# EAGLE schematic RPU_BUS (EAGLE 7.6.0)
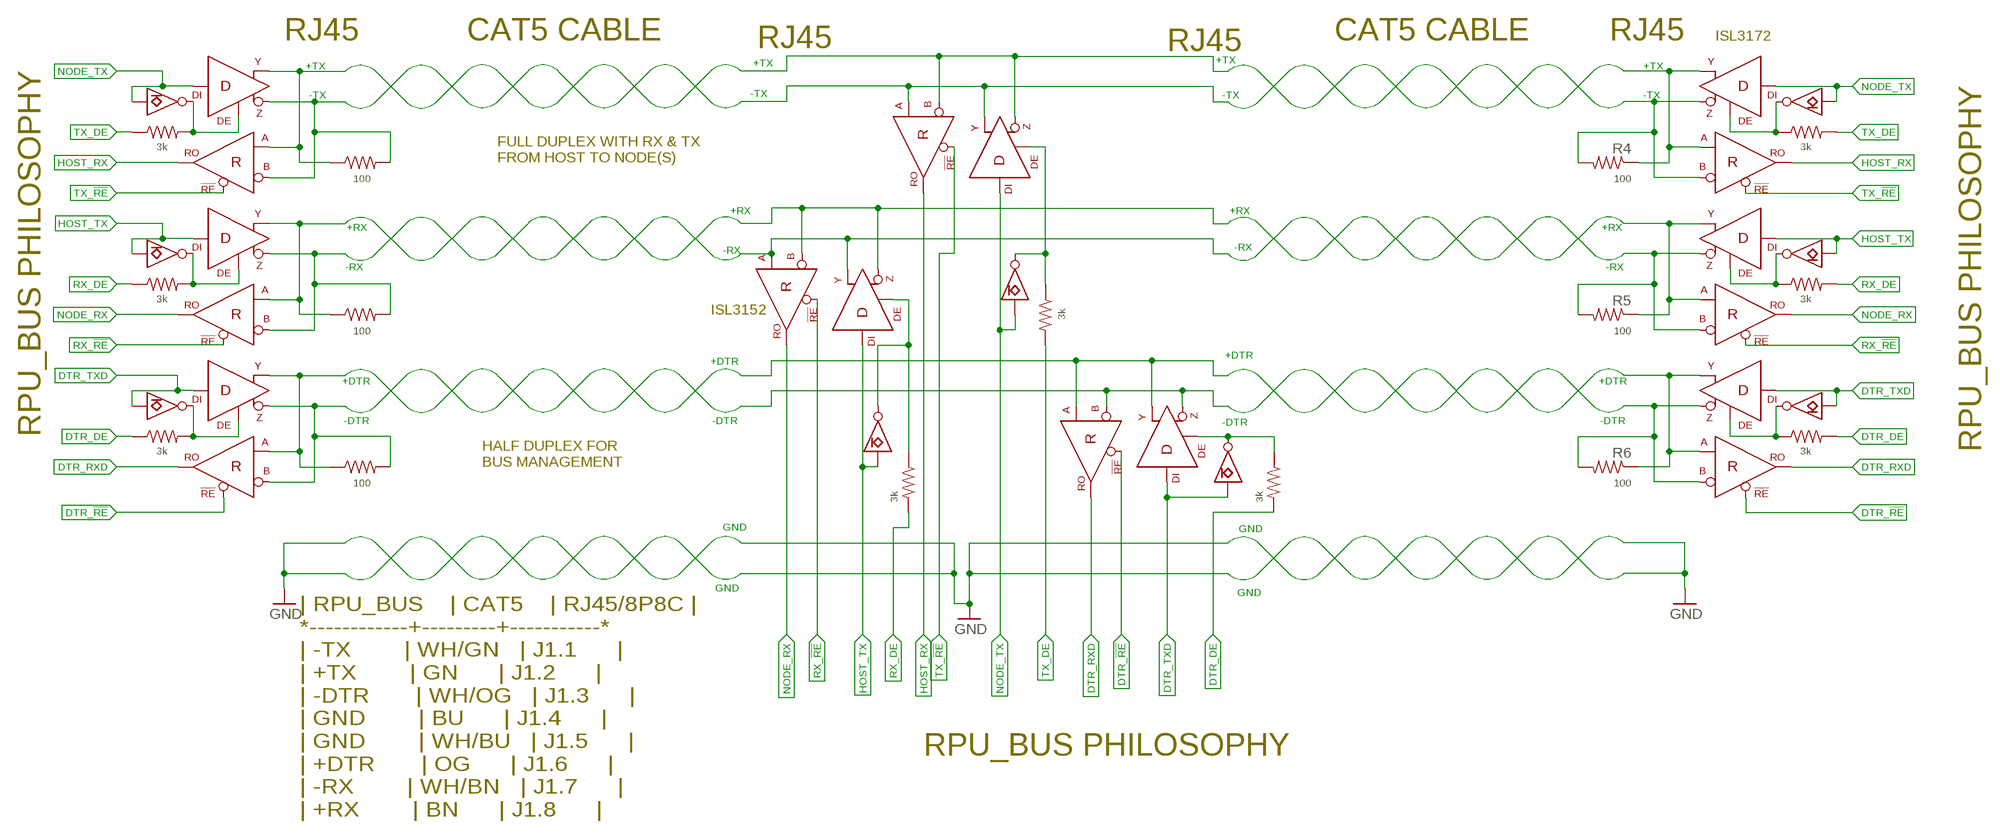
[diagram p0: schematic, sheet 1]

## Parts
R1  100  R1206  [C1206(3216)]
R2  100  R1206  [C1206(3216)]
R3  100  R1206  [C1206(3216)]
R4  100  R1206  [C1206(3216)]
R5  100  R1206  [C1206(3216)]
R6  100  R1206  [C1206(3216)]
R7  3k  R1206  [C1206(3216)]
R8  3k  R1206  [C1206(3216)]
R9  3k  R1206  [C1206(3216)]
R10  3k  R1206  [C1206(3216)]
R11  3k  R1206  [C1206(3216)]
R12  3k  R1206  [C1206(3216)]
R13  3k  R1206  [C1206(3216)]
R14  3k  R1206  [C1206(3216)]
R15  3k  R1206  [C1206(3216)]
U1  DIFF_R  [NA-10]
U2  DIFF_R  [NA-10]
U3  DIFF_R  [NA-10]
U4  DIFF_R  [NA-10]
U5  DIFF_R  [NA-10]
U6  DIFF_R  [NA-10]
U7  DIFF_R  [NA-10]
U8  DIFF_R  [NA-10]
U9  DIFF_R  [NA-10]
U$1  DIFF_D  [NA-10]
U$2  DIFF_D  [NA-10]
U$3  DIFF_D  [NA-10]
U$4  DIFF_D  [NA-10]
U$5  DIFF_D  [NA-10]
U$6  DIFF_D  [NA-10]
U$7  DIFF_D  [NA-10]
U$8  DIFF_D  [NA-10]
U$9  DIFF_D  [NA-10]
U$10  INVERT-OC  [NA-20]
U$11  INVERT-OC  [NA-20]
U$12  INVERT-OC  [NA-20]
U$13  INVERT-OC  [NA-20]
U$14  INVERT-OC  [NA-20]
U$15  INVERT-OC  [NA-20]
U$16  INVERT-OC  [NA-20]
U$17  INVERT-OC  [NA-20]
U$18  INVERT-OC  [NA-20]

## Nets
+DTR: R3.1 R6.1 U2.1(A) U4.1(A) U5.1(A) U$4.3(Y) U$5.3(Y) U$6.3(Y)
+RX: R2.1 R5.1 U1.1(A) U6.1(A) U8.4(B) U$2.4(Z) U$7.3(Y) U$9.3(Y)
+TX: R1.1 R4.1 U3.4(B) U7.1(A) U9.1(A) U$1.3(Y) U$3.3(Y) U$8.4(Z)
-DTR: R3.2 R6.2 U2.4(B) U4.4(B) U5.4(B) U$4.4(Z) U$5.4(Z) U$6.4(Z)
-RX: R2.2 R5.2 U1.4(B) U6.4(B) U8.1(A) U$2.3(Y) U$7.4(Z) U$9.4(Z)
-TX: R1.2 R4.2 U3.1(A) U7.4(B) U9.4(B) U$1.4(Z) U$3.4(Z) U$8.3(Y)
DTR_!RE: U2.2(!RE!) U4.2(!RE!) U5.2(!RE!)
DTR_DE: R9.1 R12.2 R15.2
DTR_RXD: U2.3(RO) U4.3(RO) U5.3(RO)
DTR_TXD: U$4.2(DI) U$5.2(DI) U$6.2(DI) U$14.2(IN) U$16.2(IN) U$18.2(IN)
HOST_RX: U3.3(RO) U7.3(RO) U9.3(RO)
HOST_TX: U$2.2(DI) U$7.2(DI) U$9.2(DI) U$12.2(IN) U$13.2(IN) U$15.2(IN)
N$1: R15.1 U$6.1(DE) U$18.1(!OUT)
N$2: R8.2 U$1.1(DE) U$10.1(!OUT)
N$3: R10.1 U$2.1(DE) U$15.1(!OUT)
N$4: R7.2 U$7.1(DE) U$13.1(!OUT)
N$5: R9.2 U$4.1(DE) U$14.1(!OUT)
N$6: R12.1 U$5.1(DE) U$16.1(!OUT)
N$7: R11.1 U$8.1(DE) U$11.1(!OUT)
N$8: R13.1 U$3.1(DE) U$17.1(!OUT)
N$9: R14.1 U$9.1(DE) U$12.1(!OUT)
NODE_RX: U1.3(RO) U6.3(RO) U8.3(RO)
NODE_TX: U$1.2(DI) U$3.2(DI) U$8.2(DI) U$10.2(IN) U$11.2(IN) U$17.2(IN)
RX_!RE: U1.2(!RE!) U6.2(!RE!) U8.2(!RE!)
RX_DE: R7.1 R10.2 R14.2
TX_!RE: U3.2(!RE!) U7.2(!RE!) U9.2(!RE!)
TX_DE: R8.1 R11.2 R13.2

## Notes on the sheet
- RJ45
- RJ45 | CAT5 CABLE | CAT5 CABLE | RJ45 | ISL3172
- RJ45
- FULL DUPLEX WITH RX & TX
  FROM HOST TO NODE(S)
- ISL3152
- RPU_BUS PHILOSOPHY
- RPU_BUS PHILOSOPHY
- HALF DUPLEX FOR 
  BUS MANAGEMENT
- RPU_BUS PHILOSOPHY
- | RPU_BUS    | CAT5    | RJ45/8P8C |
  *------------+---------+-----------*
  | -TX        | WH/GN   | J1.1      |
  | +TX        | GN      | J1.2      |
  | -DTR       | WH/OG   | J1.3      |
  | GND        | BU      | J1.4      |
  | GND        | WH/BU   | J1.5      |
  | +DTR       | OG      | J1.6      |
  | -RX        | WH/BN   | J1.7      |
  | +RX        | BN      | J1.8      |

## Library data of the parts
R1-R15 = R-C:R: Resiistor American-style symbol
U1-U9 = Documentation:DIFF_R: Differential Receiver
U$1-U$9 = Documentation:DIFF_D: Differential Driver
U$10-U$18 = Documentation:INVERT-OC: INVERTER OC or OD